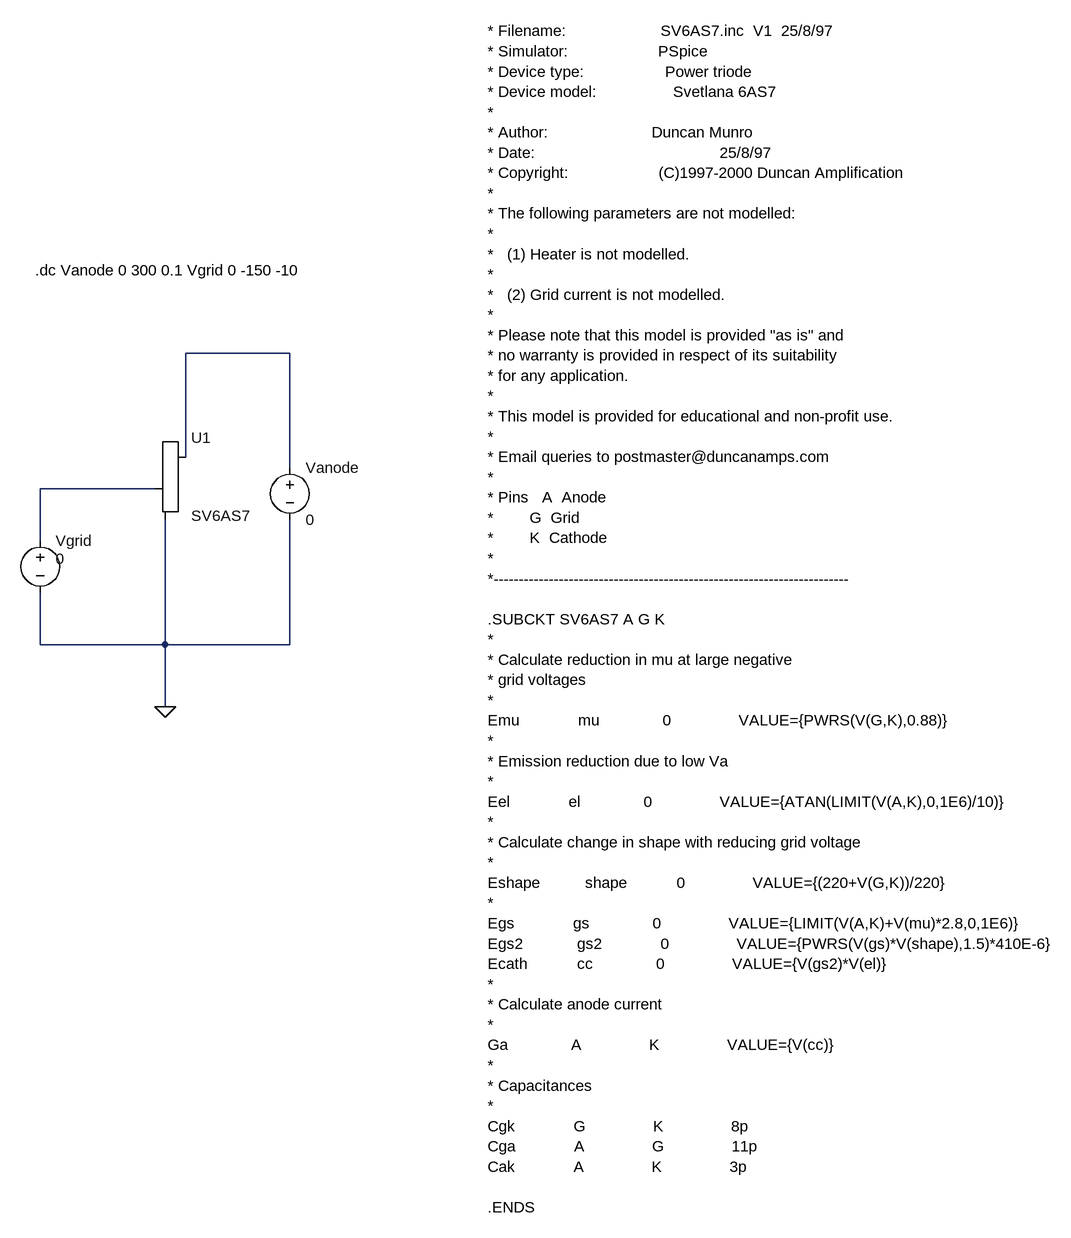
[diagram p0: schematic Svetlana 6AS7G-1a.asc]
Svetlana 6AS7G-1a.asc, the LTspice schematic file:
Version 4
SHEET 1 952 1672
WIRE -432 -48 -592 -48
WIRE -592 112 -592 -48
WIRE -432 128 -432 -48
WIRE -640 160 -816 160
WIRE -816 240 -816 160
WIRE -816 400 -816 320
WIRE -624 400 -624 208
WIRE -624 400 -816 400
WIRE -432 400 -432 208
WIRE -432 400 -624 400
WIRE -624 496 -624 400
FLAG -624 496 0
SYMBOL Misc\\triode -592 160 R0
SYMATTR InstName U1
SYMATTR Value SV6AS7
SYMBOL voltage -432 112 R0
WINDOW 123 0 0 Left 0
WINDOW 39 0 0 Left 0
SYMATTR InstName Vanode
SYMATTR Value 0
SYMBOL voltage -816 224 R0
WINDOW 3 24 44 Left 0
WINDOW 123 0 0 Left 0
WINDOW 39 0 0 Left 0
SYMATTR Value 0
SYMATTR InstName Vgrid
TEXT -128 -544 Left 0 !* Filename:                     SV6AS7.inc  V1  25/8/97\n* Simulator:                    PSpice\n* Device type:                  Power triode\n* Device model:                 Svetlana 6AS7\n*\n* Author:                       Duncan Munro\n* Date:                                         25/8/97\n* Copyright:                    (C)1997-2000 Duncan Amplification\n*\n* The following parameters are not modelled:\n*\n*   (1) Heater is not modelled.\n*\n*   (2) Grid current is not modelled.\n*\n* Please note that this model is provided "as is" and\n* no warranty is provided in respect of its suitability\n* for any application.\n*\n* This model is provided for educational and non-profit use.\n*\n* Email queries to postmaster@duncanamps.com\n*\n* Pins   A  Anode\n*        G  Grid\n*        K  Cathode\n*\n*-----------------------------------------------------------------------\n \n.SUBCKT SV6AS7 A G K\n*\n* Calculate reduction in mu at large negative\n* grid voltages\n*\nEmu             mu              0               VALUE={PWRS(V(G,K),0.88)}\n*\n* Emission reduction due to low Va\n*\nEel             el              0               VALUE={ATAN(LIMIT(V(A,K),0,1E6)/10)}\n*\n* Calculate change in shape with reducing grid voltage\n*\nEshape          shape           0               VALUE={(220+V(G,K))/220}\n*\nEgs             gs              0               VALUE={LIMIT(V(A,K)+V(mu)*2.8,0,1E6)}\nEgs2            gs2             0               VALUE={PWRS(V(gs)*V(shape),1.5)*410E-6}\nEcath           cc              0               VALUE={V(gs2)*V(el)}\n*\n* Calculate anode current\n*\nGa              A               K               VALUE={V(cc)}\n*\n* Capacitances\n*\nCgk             G               K               8p\nCga             A               G               11p\nCak             A               K               3p\n \n.ENDS
TEXT -824 -176 Left 0 !.dc Vanode 0 300 0.1 Vgrid 0 -150 -10

The netlist it stands for:
* Svetlana 6AS7G-1a.asc
XU1 N001 N002 0 SV6AS7
Vanode N001 0 0
Vgrid N002 0 0
* Filename:                     SV6AS7.inc  V1  25/8/97
* Simulator:                    PSpice
* Device type:                  Power triode
* Device model:                 Svetlana 6AS7
*
* Author:                       Duncan Munro
* Date:                                         25/8/97
* Copyright:                    (C)1997-2000 Duncan Amplification
*
* The following parameters are not modelled:
*
*   (1) Heater is not modelled.
*
*   (2) Grid current is not modelled.
*
* Please note that this model is provided "as is" and
* no warranty is provided in respect of its suitability
* for any application.
*
* This model is provided for educational and non-profit use.
*
* Email queries to postmaster@duncanamps.com
*
* Pins   A  Anode
*        G  Grid
*        K  Cathode
*
*-----------------------------------------------------------------------
.SUBCKT SV6AS7 A G K
*
* Calculate reduction in mu at large negative
* grid voltages
*
Emu             mu              0               VALUE={PWRS(V(G,K),0.88)}
*
* Emission reduction due to low Va
*
Eel             el              0               VALUE={ATAN(LIMIT(V(A,K),0,1E6)/10)}
*
* Calculate change in shape with reducing grid voltage
*
Eshape          shape           0               VALUE={(220+V(G,K))/220}
*
Egs             gs              0               VALUE={LIMIT(V(A,K)+V(mu)*2.8,0,1E6)}
Egs2            gs2             0               VALUE={PWRS(V(gs)*V(shape),1.5)*410E-6}
Ecath           cc              0               VALUE={V(gs2)*V(el)}
*
* Calculate anode current
*
Ga              A               K               VALUE={V(cc)}
*
* Capacitances
*
Cgk             G               K               8p
Cga             A               G               11p
Cak             A               K               3p
.ENDS
.dc Vanode 0 300 0.1 Vgrid 0 -150 -10
.backanno
.end